# Altium project MB1355.PrjPcb
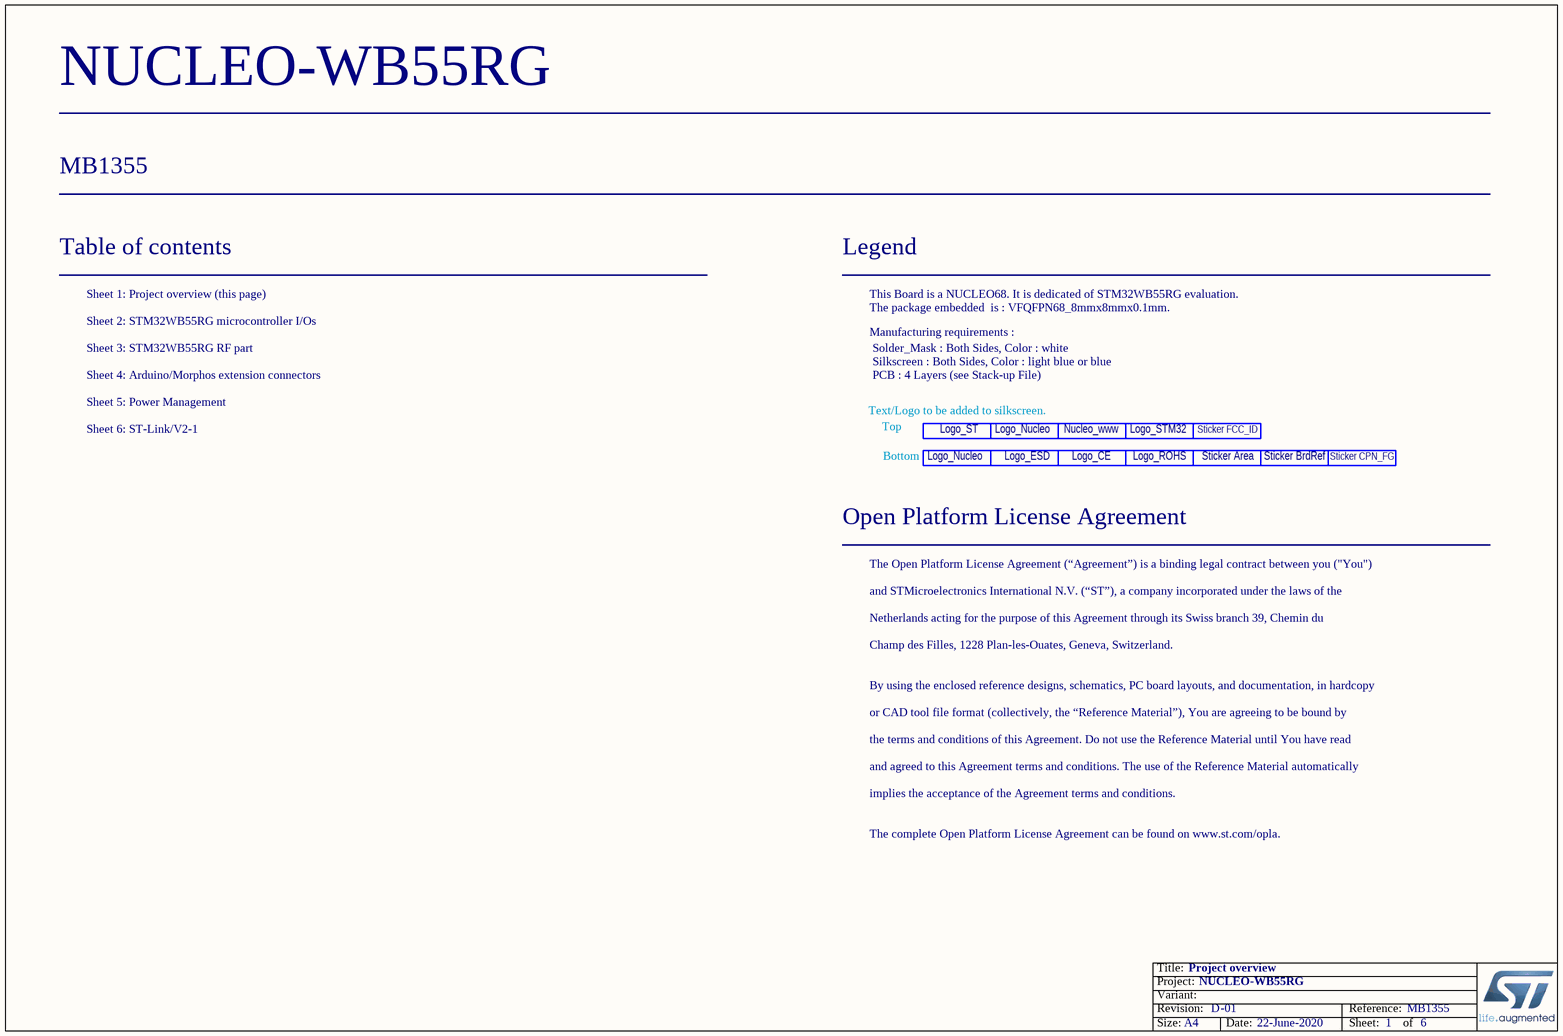
[diagram p0: Project_Overview.SchDoc]
Board_Assembly_Revision: 01; Board_Document_Date: 22-June-2020; Board_Name: NUCLEO-WB55RG; Board_PCB_Revision: D; Board_Reference: MB1355
6 sheets, 209 parts. Net scope: flat (ports and power ports of the same name join across sheets).
Board file: MB1355.PcbDoc
Sheets:
  Project_Overview.SchDoc
  MCU.SchDoc
  RF.SchDoc
  Extension_CN.SchDoc
  Power_Management.SchDoc
  ST_LINK_V2-1.SCHDOC

## Sheet Project_Overview.SchDoc: Project overview
size A4; Date: Not used; ApprovedBy: Not used; CheckedBy: Not used; Author: Ph.A; CompanyName: STMicroelectronics; DrawnBy: Not used; Engineer: Not used; Organization: Not used; Address1: Not used; Address2: Not used; Address3: Not used; Address4: Not used; DocumentNumber: Not used; Revision: Not used; SheetNumber: 1; SheetTotal: 6; CurrentTime: Not used; CurrentDate: Not used; Time: Not used; DocumentFullPathAndName: Not used; DocumentName: Not used; ModifiedDate: Not used; ImagePath: Not used; ProjectName: Not used; Application_BuildNumber: Not used

### Parts
Label_1  LOGO_ST  [LOGO_ST_Size3]  (value not drawn)
Label_2  LOGO_ROHS  [SYMBOL_RoHS]  (value not drawn)
Label_3  LOGO_Nucleo_www  [LOGO_Nucleo_www]  (value not drawn)
Label_4  LOGO_STM32  [LOGO_STM32]  (value not drawn)
Label_5  LOGO_Nucleo  [LOGO_Nucleo]  (value not drawn)
Label_6  LOGO_CE  [LOGO CE]  (value not drawn)
Label_7  LOGO_ESD  [LOGO ESD]  (value not drawn)
Label_8  LOGO_StickerArea_W21x6  [LOGO_StickerArea_Border]  (value not drawn)
Label_9  LOGO_Nucleo  [LOGO_Nucleo]  (value not drawn)
STICKER_1  FCC_ID_Sticker_16x5  [Sticker_FCC_ID 16x5mm]  (value not drawn)
STICKER_2  Sticker_BrdRef_21x5  [Sticker_BrdRef_21x5mm]  (value not drawn)
STICKER_3  Sticker_CPN_FG 16x5  [Sticker_CPN_FG 16x5mm]  (value not drawn)

### Notes on the sheet
- Table of contents
- Sheet 1: Project overview (this page)
- Legend
- This Board is a NUCLEO68. It is dedicated of STM32WB55RG evaluation.
- The package embedded  is : VFQFPN68_8mmx8mmx0.1mm.
- Sheet 2: STM32WB55RG microcontroller I/Os
- Sheet 3: STM32WB55RG RF part
- Sheet 4: Arduino/Morphos extension connectors
- Manufacturing requirements :
- Silkscreen : Both Sides, Color : light blue or blue
- Solder_Mask : Both Sides, Color : white
- PCB : 4 Layers (see Stack-up File)
- Sheet 6: ST-Link/V2-1
- Sheet 5: Power Management
- Text/Logo to be added to silkscreen.
- Top
- Bottom
- Open Platform License Agreement
- The Open Platform License Agreement (“Agreement”) is a binding legal contract between you ("You")
- and STMicroelectronics International N.V. (“ST”), a company incorporated under the laws of the
- Netherlands acting for the purpose of this Agreement through its Swiss branch 39, Chemin du
- Champ des Filles, 1228 Plan-les-Ouates, Geneva, Switzerland.
- By using the enclosed reference designs, schematics, PC board layouts, and documentation, in hardcopy
- or CAD tool file format (collectively, the “Reference Material”), You are agreeing to be bound by
- the terms and conditions of this Agreement. Do not use the Reference Material until You have read
- and agreed to this Agreement terms and conditions. The use of the Reference Material automatically
- implies the acceptance of the Agreement terms and conditions.
- The complete Open Platform License Agreement can be found on www.st.com/opla.
- Title:
- Project:
- Size:
- Revision:
- Variant:
- A4
- -
- Date:
- Reference:
- Sheet:
- of
- (in symbol LOGO_CE) Logo_CE
- (in symbol LOGO_ESD) Logo_ESD
- (in symbol LOGO_Nucleo) Logo_Nucleo
- (in symbol LOGO_Nucleo_www) Nucleo_www
- (in symbol LOGO_ROHS) Logo_ROHS
- (in symbol LOGO_ST) Logo_ST
- (in symbol LOGO_Sticker_BrdRef) Sticker BrdRef
- (in symbol LOGO_Sticker_CPN_FG) Sticker CPN_FG
- (in symbol LOGO_Sticker_FCC_ID) Sticker FCC_ID
- (in symbol LOGO_StickerArea_W21x6) Sticker Area
- (in symbol LOGO_STM32) Logo_STM32

### Library data of the parts
Label_1 = LOGO_ST: Silkscreen Only: YES
Label_2 = LOGO_ROHS: Silkscreen Only: YES
Label_4 = LOGO_STM32: Silkscreen Only: YES
Label_5 Label_9 = LOGO_Nucleo: Silkscreen Only: YES
Label_6 = LOGO_CE: Silkscreen Only: YES
Label_7 = LOGO_ESD: Silkscreen Only: YES
Label_8 = LOGO_StickerArea_W21x6: Silkscreen Only: YES
STICKER_1 = LOGO_Sticker_FCC_ID: Sticker for FCC_ID 16x5mm
STICKER_2 = LOGO_Sticker_BrdRef: Sticker_BrdRef 21x5mm
STICKER_3 = LOGO_Sticker_CPN_FG: Sticker for CPN_FG 16x5mm

## Sheet MCU.SchDoc: STM32WB55RG microcontroller I/Os
size A4; Author: Ph.A; SheetNumber: 2; SheetTotal: 6
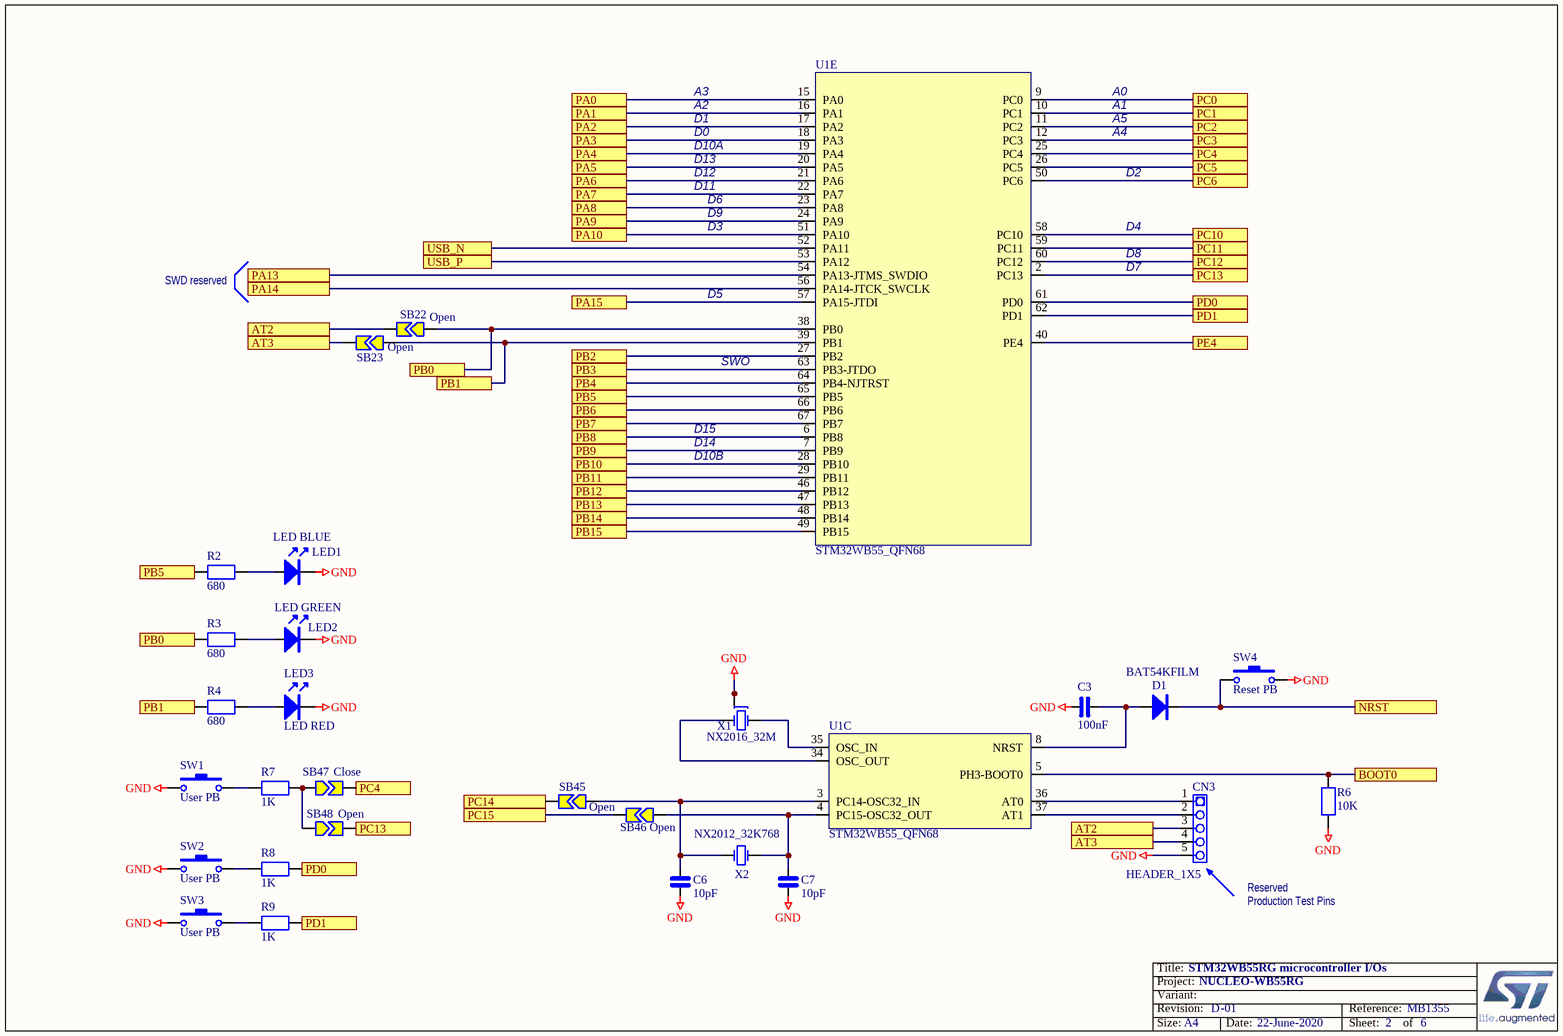
[diagram p1: MCU.SchDoc]

### Parts
C3  100nF  [0402_CAP_NPOL]
C6  10pF  [0402_CAP_NPOL]
C7  10pF  [0402_CAP_NPOL]
CN3  HEADER_1X5  [Header NF 1x5x2.54 TH]
D1  BAT54KFILM  [SOD523]
LED1  LED BLUE  [0603_LED_Blue]
LED2  LED GREEN  [0603_LED_GREEN]
LED3  LED RED  [0603_LED_RED]
R2  680  [0402_RES]
R3  680  [0402_RES]
R4  680  [0402_RES]
R6  10K  [0402_RES]
R7  1K  [0402_RES]
R8  1K  [0402_RES]
R9  1K  [0402_RES]
SB22  Open  [SB-tiny]
SB23  Open  [SB-tiny]
SB45  Open  [SB-tiny]
SB46  Open  [SB-tiny]
SB47  Close  [SB-tiny]
SB48  Open  [SB-tiny]
SW1  User PB  [SW-PB SMD KMR2]
SW2  User PB  [SW-PB SMD KMR2]
SW3  User PB  [SW-PB SMD KMR2]
SW4  Reset PB  [SW-PB SMD KMR2]
U1  STM32WB55_QFN68  [VFQFPN68_8x8x0.1_p0.4]  (parts C,E of 5)
X1  NX2016_32M  [NX2016_4P]
X2  NX2012_32K768  [NX2012_2P]

### Ports
AT2, AT3, BOOT0, NRST, PA0, PA1, PA2, PA3, PA4, PA5, PA6, PA7, PA8, PA9, PA10, PA13, PA14, PA15, PB0, PB1, PB2, PB3, PB4, PB5, PB6, PB7, PB8, PB9, PB10, PB11, PB12, PB13, PB14, PB15, PC0, PC1, PC2, PC3, PC4, PC5, PC6, PC10, PC11, PC12, PC13, PC14, PC15, PD0, PD1, PE4, USB_N, USB_P

### Nets
GND: C3.1 C6.2 C7.2 CN3.5 LED1.K LED2.K LED3.K R6.2 SW1.1 SW2.1 SW3.1 SW4.2 X1.2 X1.4
AT2: CN3.3 SB22.2 ; port AT2
AT3: CN3.4 SB23.2 ; port AT3
BOOT0: R6.1 U1.5(PH3-BOOT0) ; port BOOT0
NRST: D1.K SW4.1 ; port NRST
PA0: U1.15(PA0) ; port PA0
PA1: U1.16(PA1) ; port PA1
PA2: U1.17(PA2) ; port PA2
PA3: U1.18(PA3) ; port PA3
PA4: U1.19(PA4) ; port PA4
PA5: U1.20(PA5) ; port PA5
PA6: U1.21(PA6) ; port PA6
PA7: U1.22(PA7) ; port PA7
PA8: U1.23(PA8) ; port PA8
PA9: U1.24(PA9) ; port PA9
PA10: U1.51(PA10) ; port PA10
PA13: U1.54(PA13-JTMS_SWDIO) ; port PA13
PA14: U1.56(PA14-JTCK_SWCLK) ; port PA14
PA15: U1.57(PA15-JTDI) ; port PA15
PB0: R3.1 SB22.1 U1.38(PB0) ; port PB0
PB1: R4.1 SB23.1 U1.39(PB1) ; port PB1
PB2: U1.27(PB2) ; port PB2
PB3: U1.63(PB3-JTDO) ; port PB3
PB4: U1.64(PB4-NJTRST) ; port PB4
PB5: R2.1 U1.65(PB5) ; port PB5
PB6: U1.66(PB6) ; port PB6
PB7: U1.67(PB7) ; port PB7
PB8: U1.6(PB8) ; port PB8
PB9: U1.7(PB9) ; port PB9
PB10: U1.28(PB10) ; port PB10
PB11: U1.29(PB11) ; port PB11
PB12: U1.46(PB12) ; port PB12
PB13: U1.47(PB13) ; port PB13
PB14: U1.48(PB14) ; port PB14
PB15: U1.49(PB15) ; port PB15
PC0: U1.9(PC0) ; port PC0
PC1: U1.10(PC1) ; port PC1
PC2: U1.11(PC2) ; port PC2
PC3: U1.12(PC3) ; port PC3
PC4: SB47.2 U1.25(PC4) ; port PC4
PC5: U1.26(PC5) ; port PC5
PC6: U1.50(PC6) ; port PC6
PC10: U1.58(PC10) ; port PC10
PC11: U1.59(PC11) ; port PC11
PC12: U1.60(PC12) ; port PC12
PC13: SB48.2 U1.2(PC13) ; port PC13
PC14: SB45.2 ; port PC14
PC15: SB46.2 ; port PC15
PD0: R8.2 U1.61(PD0) ; port PD0
PD1: R9.2 U1.62(PD1) ; port PD1
PE4: U1.40(PE4) ; port PE4
USB_N: U1.52(PA11) ; port USB_N
USB_P: U1.53(PA12) ; port USB_P
NetC3_2: C3.2 D1.A U1.8(NRST)
NetC6_1: C6.1 SB45.1 U1.3(PC14-OSC32_IN) X2.1(OSC1)
NetC7_1: C7.1 SB46.1 U1.4(PC15-OSC32_OUT) X2.2(OSC2)
NetCN3_1: CN3.1 U1.36(AT0)
NetCN3_2: CN3.2 U1.37(AT1)
NetLED1_A: LED1.A R2.2
NetLED2_A: LED2.A R3.2
NetLED3_A: LED3.A R4.2
NetR7_1: R7.1 SW1.2
NetR7_2: R7.2 SB47.1 SB48.1
NetR8_1: R8.1 SW2.2
NetR9_1: R9.1 SW3.2
NetU1_34: U1.34(OSC_OUT) X1.3(OSC2)
NetU1_35: U1.35(OSC_IN) X1.1(OSC1)

### Notes on the sheet
- A2
- A3
- A0
- A1
- D12
- D13
- D0
- D1
- D10A
- A4
- A5
- D2
- D11
- D9
- D3
- D6
- D4
- SWD reserved
- D5
- D7
- D8
- SWO
- D14
- D15
- D10B
- Production Test Pins
- Reserved
- Title:
- Project:
- Size:
- Revision:
- Variant:
- -
- Date:
- Reference:
- Sheet:
- of

### Library data of the parts
C3 C6 C7 = CAP_NPOL: Capacitor_not polarized
D1 = BAT54K: Schottky Diode
LED1-LED3 = LED: Light-Emitting Diode; Part Number A: *
  LED1: Color: BLUE
R2-R4 R6-R9 = RES: Resistor
SB22 SB23 SB45-SB48 = Strap2: Solder Jumper; Solder: YES; Published: 24-Mar-1999; Revision: July-2002: Re-released for DXP Platform.; Publisher: Altium Limited
SW1-SW4 = SW-PB_1: Push-button SMD; Order code RS: 102-412
U1 = STM32WBxx_QFN68
X1 = NX2016_32M: Crystal NDK 2.0x1.6mm  32 MHz; Manufacturer P/N: NX2016SA 32 MHz EXS00A-CS06654; Ref: NX2016SA 32MHz  EXS00A-CS06654  Référence interne NDK : X5087283; Manufacturer: NDK
X2 = NX2012_32K768: Crystal NDK 2.0x1.2mm  32.768 KHz; Manufacturer P/N: NX2012SA 32.768KHz  EXS00A-MU00389; Ref: NX2012SA 32.768KHz  EXS00A-MU00389  Référence interne NDK : X3037088; Manufacturer: NDK

## Sheet RF.SchDoc: STM32WB55RG RF part
size A4; Author: PhA; SheetNumber: 3; SheetTotal: 6
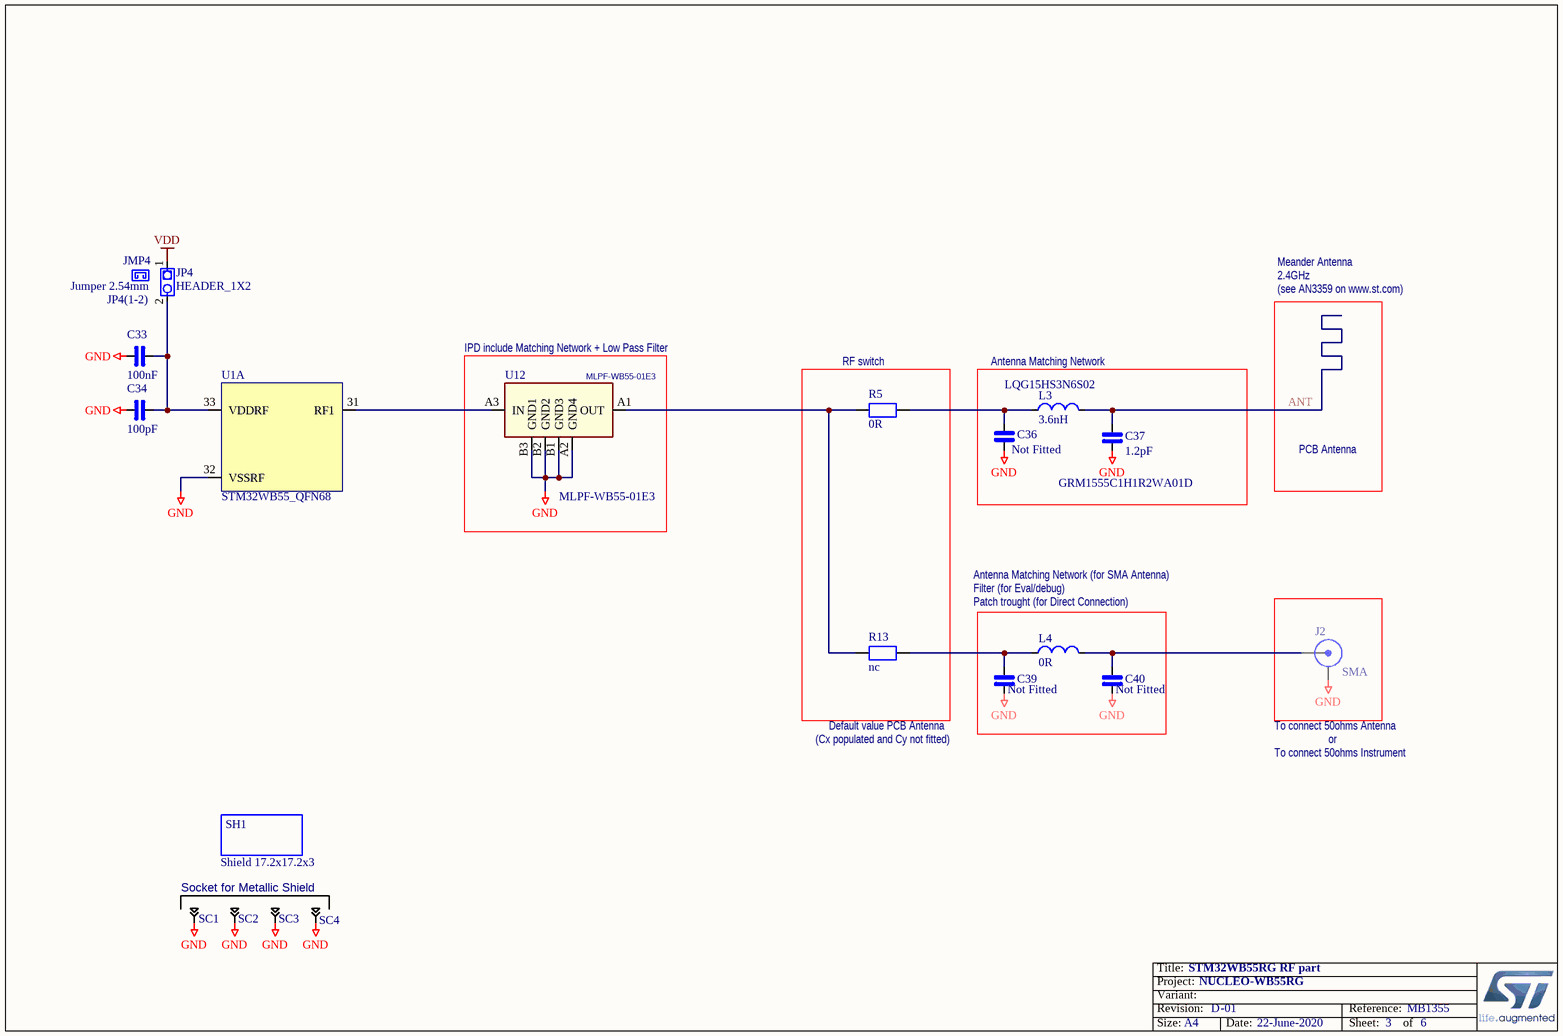
[diagram p2: RF.SchDoc]

### Parts
C33  100nF  [0402_CAP_NPOL]
C34  100pF  [0402_CAP_NPOL]
C36  Fitted: Not Fitted  [0402_CAP_NPOL]
C37  1.2pF  Ref: GRM1555C1H1R2WA01D  [0402_CAP_NPOL]
C39  Fitted: Not Fitted  [0402_CAP_NPOL]
C40  Fitted: Not Fitted  [0402_CAP_NPOL]
J2  SMA  [SMA_T_9.52_NF]
JMP4  Jumper 2.54mm  default: JP4(1-2)  [Jumper 2.54mm BLACK]
JP4  HEADER_1X2  [Header M 1x2x2.54 TH V]
L3  3.6nH  Ref: LQG15HS3N6S02  [0402_COIL]
L4  0R  [0402_COIL]
R5  0R  [0402_RES]
R13  nc  [0402_RES]
SC1  Shield Clip_A 3.9x1.1x1.28  [Shield Clip_A 3.9x1.1x1.28]  (value not drawn)
SC2  Shield Clip_A 3.9x1.1x1.28  [Shield Clip_A 3.9x1.1x1.28]  (value not drawn)
SC3  Shield Clip_A 3.9x1.1x1.28  [Shield Clip_A 3.9x1.1x1.28]  (value not drawn)
SC4  Shield Clip_A 3.9x1.1x1.28  [Shield Clip_A 3.9x1.1x1.28]  (value not drawn)
SH1  Shield 17.2x17.2x3  [Shield 17.2x17.2x3]
U1  STM32WB55_QFN68  [VFQFPN68_8x8x0.1_p0.4]  (part A of 5)
U12  MLPF-WB55-01E3  [ST_CSP650x58P2x3_160x100x42]

### Blocks framed on the sheet
IPD include Matching Network + Low Pass Filter: U12
RF switch: R5 R13
Antenna Matching Network: C36 C37 L3

### Nets
GND: C33.1 C34.1 C36.2 C37.1 C39.1 C40.1 J2.2(Y) SC1.1 SC2.1 SC3.1 SC4.1 U1.32(VSSRF) U12.A2(GND4) U12.B1(GND3) U12.B2(GND2) U12.B3(GND1)
VDD: JP4.1
ANT: C37.2 L3.2
NetC33_2: C33.2 C34.2 JP4.2 U1.33(VDDRF)
NetC36_1: C36.1 L3.1 R5.2
NetC39_2: C39.2 L4.1 R13.2
NetC40_2: C40.2 J2.1(X) L4.2
NetR5_1: R5.1 R13.1 U12.A1(OUT)
NetU1_31: U1.31(RF1) U12.A3(IN)

### Notes on the sheet
- Meander Antenna
- 2.4GHz
- (see AN3359 on www.st.com)
- PCB Antenna
- Antenna Matching Network (for SMA Antenna)
- Filter (for Eval/debug)
- Patch trought (for Direct Connection)
- (near C39) (Cx populated and Cy not fitted)
- Default value PCB Antenna
- To connect 50ohms Antenna
- To connect 50ohms Instrument
- or
- Socket for Metallic Shield
- Title:
- Project:
- Size:
- Revision:
- Variant:
- A4
- -
- Date:
- Reference:
- Sheet:
- of

### Library data of the parts
C33 C34 C36 C37 C39 C40 = CAP_NPOL: Capacitor_not polarized
  C37: Fitted: Fitted
JP4 = HEADER_1X2_L
L3 L4 = INDUCTOR_SMD_STDL
R5 R13 = RES: Resistor
SC1-SC4 = Shield Clip_A 3.9x1.1x1.28: Harwin S0951-46R
SH1 = Shield
U1 = STM32WBxx_QFN68
U12 = MCD-02059: 2.4 GHz low pass filter matched to STM32WBx5Cx/Rx; Part_Type: IC; Manufacturer: STMICROELECTRONICS; ECCN_US: EAR99; ECCN_EU: NEC; Provided_By: SUBCO with ST control; Internal_Part_Number: MCD-02059; Value: MLPF-WB55-01E3; Status: New; Manufacturer_Part_Number: MLPF-WB55-01E3; Package: Bumpless CSP; ComponentLink1Description: Datasheet; ComponentLink1URL: http://tunmcdsvn.tun.st.com/Component_Datasheet_Library/Trunk/IC/STM_Filter_MLPF-WB55-01E3/STM_Filter_MLPF-WB55-01E3.pdf

## Sheet Extension_CN.SchDoc: Arduino/Morphos extension connectors
size A4; Author: Ph.A; SheetNumber: 4; SheetTotal: 6
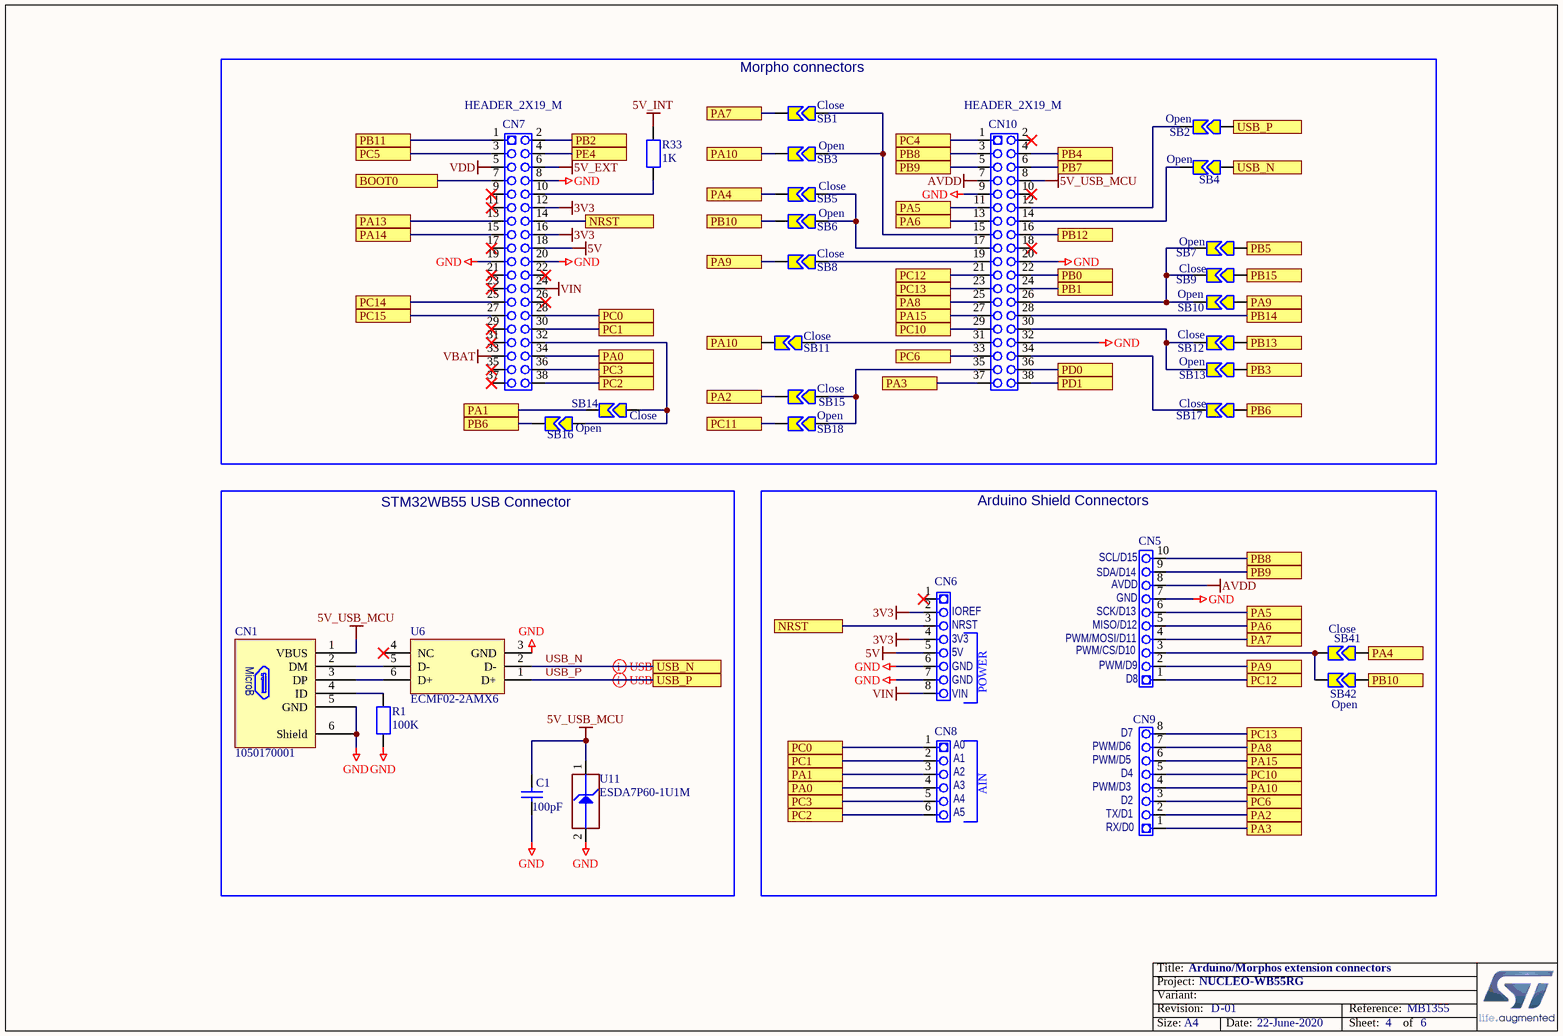
[diagram p3: Extension_CN.SchDoc]

### Parts
C1  value 100pF  [C0402]  (hidden comment: Capacitor)
CN1  1050170001  [USBMICROB_MOLEX_105017-0001_H2P90]
CN5  HEADER_1X10  [Header F 1x10x2.54 TH V]  (value not drawn)
CN6  HEADER_1X8_F  [Header F 1x8x2.54 TH V]  (value not drawn)
CN7  HEADER_2X19_M  [Header M 2x19x2.54 TH M_top + M_bottom]
CN8  HEADER_1X6  [Header F 1x6x2.54 TH V]  (value not drawn)
CN9  HEADER_1X8_F  [Header F 1x8x2.54 TH V]  (value not drawn)
CN10  HEADER_2X19_M  [Header M 2x19x2.54 TH M_top + M_bottom]
R1  100K  [0402_RES]
R33  1K  [0402_RES]
SB1  Close  [SB-tiny]
SB2  Open  [SB-tiny]
SB3  Open  [SB-tiny]
SB4  Open  [SB-tiny]
SB5  Close  [SB-tiny]
SB6  Open  [SB-tiny]
SB7  Open  [SB-tiny]
SB8  Close  [SB-tiny]
SB9  Close  [SB-tiny]
SB10  Open  [SB-tiny]
SB11  Close  [SB-tiny]
SB12  Close  [SB-tiny]
SB13  Open  [SB-tiny]
SB14  Close  [SB-tiny]
SB15  Close  [SB-tiny]
SB16  Open  [SB-tiny]
SB17  Close  [SB-tiny]
SB18  Open  [SB-tiny]
SB41  Close  [SB-tiny]
SB42  Open  [SB-tiny]
U6  ECMF02-2AMX6  [ESD_QFN-6L_1P7X1P5_P050]
U11  value ESDA7P60-1U1M  [ESD_QFN2_1P6X1_P125]  (hidden comment: ESD-TRANSIL)

### Blocks framed on the sheet
Morpho connectors: CN7 CN10 R33 SB1-SB18
STM32WB55 USB Connector: C1 CN1 R1 U6 U11
Arduino Shield Connectors: CN5 CN6 CN8 CN9 SB41 SB42

### Ports
BOOT0, NRST, PA0, PA1, PA2, PA3, PA4, PA5, PA6, PA7, PA8, PA9, PA10, PA13, PA14, PA15, PB0, PB1, PB2, PB3, PB4, PB5, PB6, PB7, PB8, PB9, PB10, PB11, PB12, PB13, PB14, PB15, PC0, PC1, PC2, PC3, PC4, PC5, PC6, PC10, PC11, PC12, PC13, PC14, PC15, PD0, PD1, PE4, USB_N, USB_P

### Nets
3V3: CN6.2 CN6.4 CN7.12 CN7.16
5V: CN6.5 CN7.18
5V_EXT: CN7.6
5V_INT: R33.2
5V_USB_MCU: C1.2 CN1.1(VBUS) CN10.8 U11.1(IO1)
AVDD: CN5.8 CN10.7
GND: C1.1 CN1.5(GND) CN1.6(Shield) CN5.7 CN6.6 CN6.7 CN7.8 CN7.19 CN7.20 CN10.9 CN10.20 CN10.32 R1.1 U6.3(GND) U11.2(GND)
VBAT: CN7.33
VDD: CN7.5
VIN: CN6.8 CN7.24
BOOT0: CN7.7 ; port BOOT0
NRST: CN6.3 CN7.14 ; port NRST
PA0: CN7.34 CN8.4 ; port PA0
PA1: CN8.3 SB14.2 ; port PA1
PA2: CN9.2 SB15.2 ; port PA2
PA3: CN9.1 CN10.37 ; port PA3
PA4: SB5.2 SB41.1 ; port PA4
PA5: CN5.6 CN10.11 ; port PA5
PA6: CN5.5 CN10.13 ; port PA6
PA7: CN5.4 SB1.2 ; port PA7
PA8: CN9.7 CN10.25 ; port PA8
PA9: CN5.2 SB8.2 SB10.1 ; port PA9
PA10: CN9.4 SB3.2 SB11.2 ; port PA10
PA13: CN7.13 ; port PA13
PA14: CN7.15 ; port PA14
PA15: CN9.6 CN10.27 ; port PA15
PB0: CN10.22 ; port PB0
PB1: CN10.24 ; port PB1
PB2: CN7.2 ; port PB2
PB3: SB13.1 ; port PB3
PB4: CN10.4 ; port PB4
PB5: SB7.1 ; port PB5
PB6: SB16.2 SB17.1 ; port PB6
PB7: CN10.6 ; port PB7
PB8: CN5.10 CN10.3 ; port PB8
PB9: CN5.9 CN10.5 ; port PB9
PB10: SB6.2 SB42.1 ; port PB10
PB11: CN7.1 ; port PB11
PB12: CN10.16 ; port PB12
PB13: SB12.1 ; port PB13
PB14: CN10.28 ; port PB14
PB15: SB9.1 ; port PB15
PC0: CN7.28 CN8.1 ; port PC0
PC1: CN7.30 CN8.2 ; port PC1
PC2: CN7.38 CN8.6 ; port PC2
PC3: CN7.36 CN8.5 ; port PC3
PC4: CN10.1 ; port PC4
PC5: CN7.3 ; port PC5
PC6: CN9.3 CN10.33 ; port PC6
PC10: CN9.5 CN10.29 ; port PC10
PC11: SB18.2 ; port PC11
PC12: CN5.1 CN10.21 ; port PC12
PC13: CN9.8 CN10.23 ; port PC13
PC14: CN7.25 ; port PC14
PC15: CN7.27 ; port PC15
PD0: CN10.36 ; port PD0
PD1: CN10.38 ; port PD1
PE4: CN7.4 ; port PE4
USB_N: SB4.1 U6.2(D-) ; port USB_N
USB_P: SB2.1 U6.1(D+) ; port USB_P
NetCN1_2: CN1.2(DM) U6.5(D-)
NetCN1_3: CN1.3(DP) U6.6(D+)
NetCN1_4: CN1.4(ID) R1.2
NetCN5_3: CN5.3 SB41.2 SB42.2
NetCN7_10: CN7.10 R33.1
NetCN7_32: CN7.32 SB14.1 SB16.1
NetCN10_12: CN10.12 SB2.2
NetCN10_14: CN10.14 SB4.2
NetCN10_15: CN10.15 SB1.1 SB3.1
NetCN10_17: CN10.17 SB5.1 SB6.1
NetCN10_19: CN10.19 SB8.1
NetCN10_26: CN10.26 SB7.2 SB9.2 SB10.2
NetCN10_30: CN10.30 SB12.2 SB13.2
NetCN10_31: CN10.31 SB11.1
NetCN10_34: CN10.34 SB17.2
NetCN10_35: CN10.35 SB15.1 SB18.1

Not connected (* = marked no-connect by the designer): CN6 1*; CN7 9* 11* 17* 21* 22* 23* 26* 29* 31* 35* 37*; CN10 2* 10* 18*; U6 4(NC)*

### Layout directives
differential pair; net class DIFF90: USB_N, USB_P

### Notes on the sheet
- (near CN5) SDA/D14
- (near CN5) SCL/D15
- (near CN6) 3V3
- (near CN6) NRST
- (near CN6) IOREF
- (near CN5) PWM/MOSI/D11
- (near CN5) PWM/CS/D10
- (near CN5) MISO/D12
- (near CN5) SCK/D13
- (near CN5) AVDD
- (near CN5) GND
- (near CN6) GND
- (near CN6) VIN
- (near CN6) 5V
- (near CN6) POWER
- (near CN5) PWM/D9
- (near CN5) D8
- (near CN8) A0
- (near CN8) A1
- (near CN8) A2
- (near CN8) A3
- (near CN8) AIN
- (near CN9) PWM/D3
- (near CN9) PWM/D5
- (near CN9) PWM/D6
- (near CN9) D4
- (near CN9) D7
- (near CN8) A5
- (near CN8) A4
- (near CN9) RX/D0
- (near CN9) TX/D1
- (near CN9) D2
- Title:
- Project:
- Size:
- Revision:
- Variant:
- -
- Date:
- Reference:
- Sheet:
- of
- (in symbol 1050170001) MicroB

### Library data of the parts
C1 = MCD-00205: Capacitor, MLCC, 100pF, 50V, NPO, 5%, 0402, T=0,5mm; Manufacturer_Part_Number: CC0402JRNPO9BN101; Manufacturer: YAGEO; ECCN_US: EAR99; ECCN_EU: NEC; Provided_By: SUBCO; Internal_Part_Number: MCD-00205; Status: Released; Part_Type: Capacitor; Package: C0402; ComponentLink1Description: Datasheet; ComponentLink1URL: http://tunmcdsvn.tun.st.com/Component_Datasheet_Library/Trunk/Capacitors/Yageo_Capacitor_NP0_16V-to-50V
CN1 = 1050170001: USB-MICRO-B, 1050170001, SMT, MOLEX; Fitted: YES; Ordered_By: Subcon; ECCN_US/EU: n/a; Manuf_1: MOLEX; Manuf_Part_1: 1050170001; Distrib: DIGIKEY; Value: 1050170001; Order_Code: *
CN6 = HEADER_1X8: Specific Function: Arduino Power
CN7 = HEADER_2X19: Specific Function: Morpho CN7
CN9 = HEADER_1X8: Specific Function: Arduino Digital 1
CN10 = HEADER_2X19: Specific Function: Morpho CN10
R1 R33 = RES: Resistor
SB1-SB18 SB41 SB42 = Strap2: Solder Jumper; Solder: YES; Published: 24-Mar-1999; Revision: July-2002: Re-released for DXP Platform.; Publisher: Altium Limited
U6 = MCD-00649: Common mode filter with ESD protection for USB 2.0 interface; Part_Type: Diode; Manufacturer: STMICROELECTRONICS; BMS_Part_Number: 9151138; ECCN_US: EAR99; ECCN_EU: NEC; Provided_By: SUBCO with ST control; Internal_Part_Number: MCD-00649; Value: ECMF02-2AMX6; Status: Released; Manufacturer_Part_Number: ECMF02-2AMX6; ComponentLink1Description: Datasheet; ComponentLink1URL: http://tunmcdsvn.tun.st.com/Component_Datasheet_Library/Trunk/Diodes/STM_ESD_ECMF02-2AMX6
U11 = MCD-00251: High power transient voltage suppressor, 7V breakdown; Part_Type: Diode; Manufacturer: STMICROELECTRONICS; BMS_Part_Number: 9179042; ECCN_US: EAR99; ECCN_EU: NEC; Provided_By: SUBCO with ST control; Internal_Part_Number: MCD-00251; Status: Released; Manufacturer_Part_Number: ESDA7P60-1U1M; ComponentLink1Description: Datasheet; ComponentLink1URL: http://tunmcdsvn.tun.st.com/Component_Datasheet_Library/Trunk/Diodes/STM_ESD_ESDA7P60-1U1M

## Sheet Power_Management.SchDoc: Power Management
size A4; Author: Ph.A; SheetNumber: 5; SheetTotal: 6
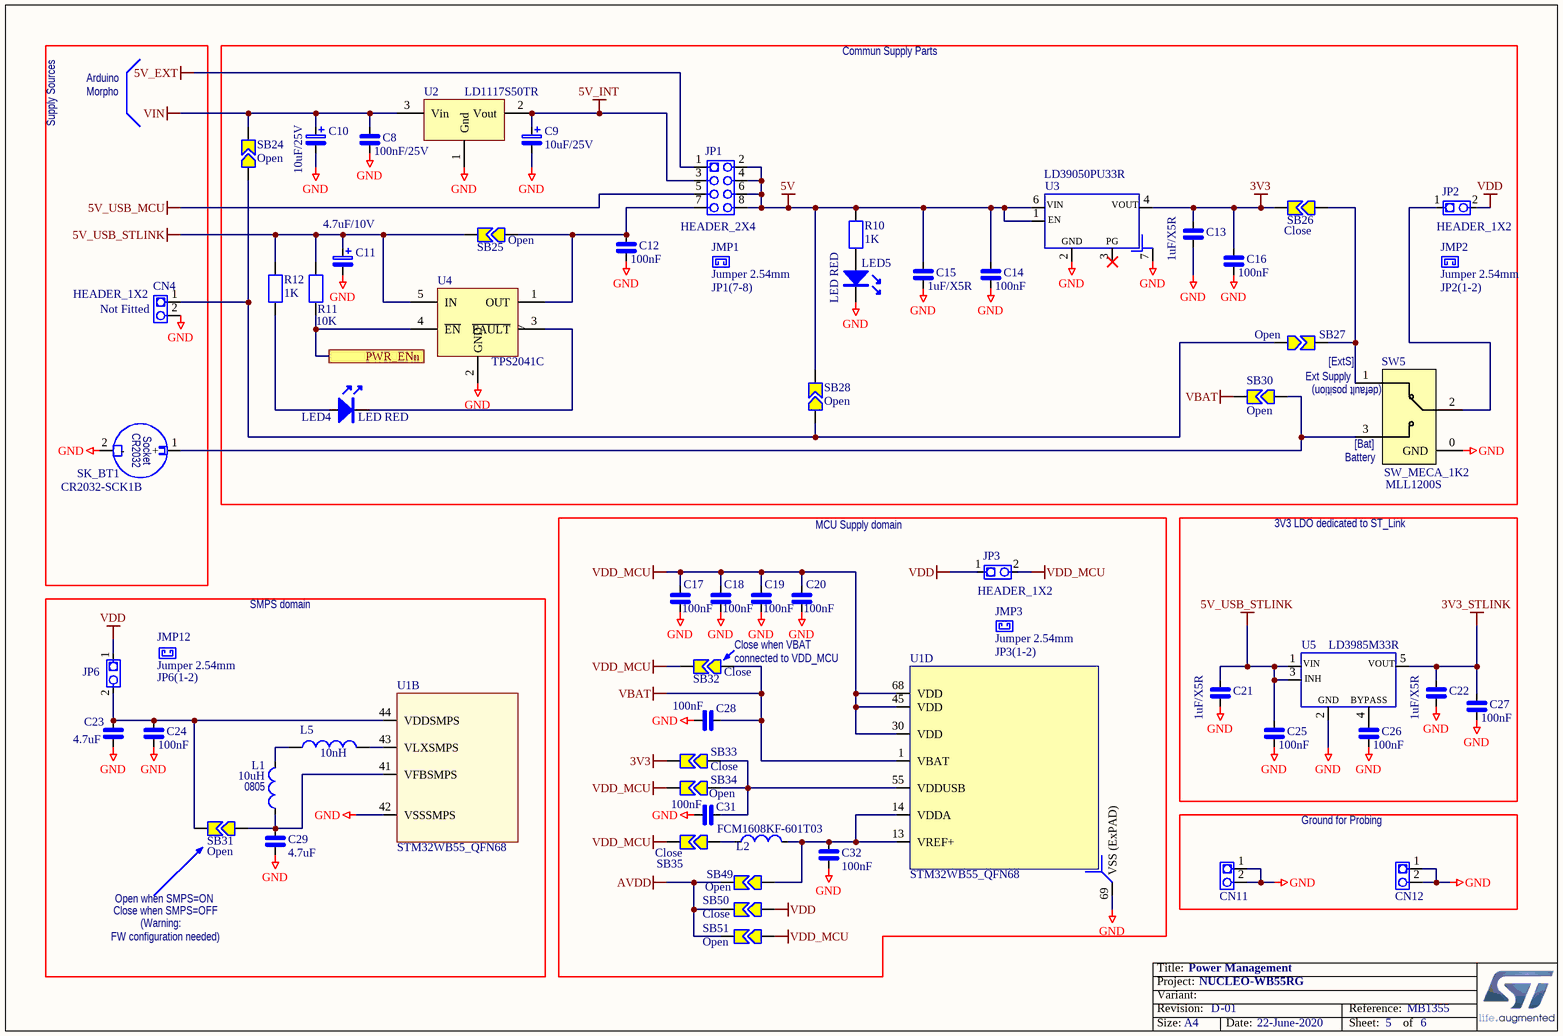
[diagram p4: Power_Management.SchDoc]

### Parts
C8  100nF/25V  [0402_CAP_NPOL]
C9  10uF/25V  [1210_CAP_POL]
C10  10uF/25V  [1210_CAP_POL]
C11  4.7uF/10V  [1210_CAP_POL]
C12  100nF  [0402_CAP_NPOL]
C13  1uF/X5R  [0603_CAP_NPOL]
C14  100nF  [0402_CAP_NPOL]
C15  1uF/X5R  [0603_CAP_NPOL]
C16  100nF  [0402_CAP_NPOL]
C17  100nF  [0402_CAP_NPOL]
C18  100nF  [0402_CAP_NPOL]
C19  100nF  [0402_CAP_NPOL]
C20  100nF  [0402_CAP_NPOL]
C21  1uF/X5R  [0603_CAP_NPOL]
C22  1uF/X5R  [0603_CAP_NPOL]
C23  4.7uF  [0402_CAP_NPOL]
C24  100nF  [0402_CAP_NPOL]
C25  100nF  [0402_CAP_NPOL]
C26  100nF  [0402_CAP_NPOL]
C27  100nF  [0402_CAP_NPOL]
C28  100nF  [0402_CAP_NPOL]
C29  4.7uF  [0402_CAP_NPOL]
C31  100nF  [0402_CAP_NPOL]
C32  100nF  [0402_CAP_NPOL]
CN4  HEADER_1X2  Fitted: Not Fitted  [Header NF 1x2x2.54 TH]
CN11  HEADER_1X2  [Header M 1x2x2.54 TH V]  (value not drawn)
CN12  HEADER_1X2  [Header M 1x2x2.54 TH V]  (value not drawn)
JMP1  Jumper 2.54mm  Default: JP1(7-8)  [Jumper 2.54mm BLACK]
JMP2  Jumper 2.54mm  Default: JP2(1-2)  [Jumper 2.54mm BLACK]
JMP3  Jumper 2.54mm  default: JP3(1-2)  [Jumper 2.54mm BLACK]
JMP12  Jumper 2.54mm  default: JP6(1-2)  [Jumper 2.54mm BLACK]
JP1  HEADER_2X4  [Header M 2x4x2.54 TH V]
JP2  HEADER_1X2  [Header M 1x2x2.54 TH V]
JP3  HEADER_1X2  [Header M 1x2x2.54 TH V]
JP6  HEADER_1X2  [Header M 1x2x2.54 TH V]  (value not drawn)
L1  10uH  [0805_COIL]
L2  FCM1608KF-601T03  [0603_COIL]
L5  value 10nH  [IND_0402_MURATA_LQW15AN_H0P5]  (hidden comment: Inductor)
LED4  LED RED  [0603_LED_RED]
LED5  LED RED  [0603_LED_RED]
R10  1K  [0402_RES]
R11  10K  [0402_RES]
R12  1K  [0402_RES]
SB24  Open  [SB-tiny]
SB25  Open  [SB-tiny]
SB26  Close  [SB-tiny]
SB27  Open  [SB-tiny]
SB28  Open  [SB-tiny]
SB30  Open  [SB-tiny]
SB31  Open  [SB-tiny]
SB32  Close  [SB-tiny]
SB33  Close  [SB-tiny]
SB34  Open  [SB-tiny]
SB35  Close  [SB-tiny]
SB49  Open  [SB-tiny]
SB50  Close  [SB-tiny]
SB51  Open  [SB-tiny]
SK_BT1  CR2032-SCK1B  [CR2032-SCK1]
SW5  SW_MECA_1K2  value MLL1200S  [SWI_SPDT-RA_TE-CONNECTIVITY_MLL1200S_1P2T]
U1  STM32WB55_QFN68  [VFQFPN68_8x8x0.1_p0.4]  (parts B,D of 5)
U2  LD1117S50TR  [SOT223_SC73_A]
U3  LD39050PU33R  [DFN6 3x3mm]
U4  TPS2041C  [MOS_SOT23-5L]
U5  LD3985M33R  [SOT23-5]

### Blocks framed on the sheet
3V3 LDO dedicated to ST_Link: C21 C22 C25-C27 U5
Ground for Probing: CN11 CN12

### Ports
PWR_ENn

### Nets
3V3: C13.1 C16.1 SB26.2 SB33.2 U3.4(VOUT)
3V3_STLINK: C22.1 C27.1 U5.5(VOUT)
5V: C14.1 C15.1 JP1.2 JP1.4 JP1.6 JP1.8 R10.1 SB28.2 U3.1(EN) U3.6(VIN)
5V_EXT: JP1.1
5V_INT: C9.1 JP1.3 U2.2(Vout)
5V_USB_MCU: JP1.5
5V_USB_STLINK: C11.1 C21.1 C25.1 R11.1 R12.1 SB25.2 U4.5(IN) U5.1(VIN) U5.3(CE)
AVDD: SB49.2 SB50.2 SB51.2
GND: C8.2 C9.2 C10.2 C11.2 C12.2 C13.2 C14.2 C15.2 C16.2 C17.2 C18.2 C19.2 C20.2 C21.2 C22.2 C23.2 C24.2 C25.2 C26.2 C27.2 C28.2 C29.2 C31.2 C32.2 CN4.2 CN11.1 CN11.2 CN12.1 CN12.2 LED5.K SK_BT1.2(-) SW5.0(GND) U1.42(VSSSMPS) U1.69(VSS_(ExPAD)) U2.1(Gnd) U3.2(VSS) U3.7 U4.2(GND) U5.2(VSS)
VBAT: C28.1 SB30.2 SB32.1 U1.1(VBAT)
VDD: JP2.2 JP3.1 JP6.1 SB50.1
VDD_MCU: C17.1 C18.1 C19.1 C20.1 JP3.2 SB32.2 SB34.2 SB35.2 SB51.1 U1.30(VDD) U1.45(VDD) U1.68(VDD)
VIN: C8.1 C10.1 SB24.2 U2.3(Vin)
PWR_ENn: R11.2 U4.4(~{EN}) ; port PWR_ENn
NetC12_1: C12.1 JP1.7 SB25.1 U4.1(OUT)
NetC23_1: C23.1 C24.1 JP6.2 SB31.2 U1.44(VDDSMPS)
NetC26_1: C26.1 U5.4(BYPASS)
NetC29_1: C29.1 L1.1 SB31.1 U1.41(VFBSMPS)
NetC31_1: C31.1 SB33.1 SB34.1 U1.55(VDDUSB)
NetC32_1: C32.1 L2.2 SB49.1 U1.13(VREF+) U1.14(VDDA)
NetCN4_1: CN4.1 SB24.1 SB27.1 SB28.1
NetJP2_1: JP2.1 SW5.2
NetL1_2: L1.2 L5.1
NetL2_1: L2.1 SB35.1
NetL5_2: L5.2 U1.43(VLXSMPS)
NetLED4_A: LED4.A R12.2
NetLED4_K: LED4.K U4.3(~{FAULT})
NetLED5_A: LED5.A R10.2
NetSB26_1: SB26.1 SB27.2 SW5.1
NetSB30_1: SB30.1 SK_BT1.1(+) SW5.3

Not connected (* = marked no-connect by the designer): U3 3(PG)*

### Notes on the sheet
- Arduino
- Morpho
- Commun Supply Parts
- Supply Sources
- Ext Supply
- [ExtS]
- (default position)
- (near SW5) [Bat]
- (near SW5) Battery
- MCU Supply domain
- SMPS domain
- (near SB32) Close when VBAT
- (near SB32) connected to VDD_MCU
- (near L1) 0805
- Close when SMPS=OFF
- Open when SMPS=ON
- FW configuration needed)
- (Warning:
- Title:
- Project:
- Size:
- Revision:
- Variant:
- A4
- -
- Date:
- Reference:
- Sheet:
- of
- (in symbol CR2032-SCK1B) CR2032; Socket
- (in symbol LD3985M33R) INH; GND
- (in symbol LD39050PU33R) GND

### Library data of the parts
C8 C12-C29 C31 C32 = CAP_NPOL: Capacitor_not polarized
C9-C11 = CAP_POL: Condensateur_polarise
JP2 JP3 JP6 = HEADER_1X2_L
L1 = IND_74479777310A: Coil Wurtz 10uH ref: 74479777310A
L2 = IND_FCM1608KF-601T03
L5 = MCD-02063: inductor, 10nH +-2%, 100mA max,1.3 ohm DC max, Q min = 13,0402; Manufacturer_Part_Number: LQP15MN10NG02; Manufacturer: MURATA; ECCN_US: EAR99; ECCN_EU: NEC; Provided_By: SUBCO; Order_Code_RS: 167-3827; Internal_Part_Number: MCD-02063; Status: Checked; Part_Type: Inductor; Package: L0402; ComponentLink1Description: Datasheet; ComponentLink1URL: http://tunmcdsvn.tun.st.com/Component_Datasheet_Library/Trunk/Inductors/Murata_inductor_LQP15MN10NG02/Murata_inductor_LQP15MN10NG02.pdf; Alternate_Manufacturer_Part_Number: N/A; Alternate_Manufacturer: N/A; Order_Code_Digikey: 490-6743-1-ND; Order_Code_Farnell: 1762617
LED4 LED5 = LED: Light-Emitting Diode; Part Number A: *
R10-R12 = RES: Resistor
SB24-SB28 SB30-SB35 SB49-SB51 = Strap2: Solder Jumper; Solder: YES; Published: 24-Mar-1999; Revision: July-2002: Re-released for DXP Platform.; Publisher: Altium Limited
SW5 = MCD-02081: SPDT RA SMT SLIDE SWITCH; Part_Type: Connector; Manufacturer: TE_Connectivity; ECCN_US: EAR99; ECCN_EU: NEC; Provided_By: SUBCO; Internal_Part_Number: MCD-02081; Status: Checked; Manufacturer_Part_Number: MLL1200S; ComponentLink1Description: Datasheet; ComponentLink1URL: http://tunmcdsvn.tun.st.com/Component_Datasheet_Library/Trunk/Connectors/TE_Connectivity_MLL1200S/TE_MLL1200S.pdf
U1 = STM32WBxx_QFN68
U2 = LD1117S50TR: IC REG LDO 5V 0.8A SOT223; Manuf_1: STM; ECCN_US/EU: EAR99/NEC; Ref St: 9176133; Fitted: YES; Manuf_Part_1: LD1117S50TR; Distrib: STM; Ordered_By: STM; Order_code: LD1117S50TR; Value: LD1117S50TR
U3 = LD39050PU33R: 3.3V voltage regulator 500mA
U4 = MCD-01785: 5V Power Switch, 0.85A, RDSon 130mOhm max, with active low enable pin; Part_Type: IC; Manufacturer_Part_Number: TPS2041CDBVT; Manufacturer: TEXAS INSTRUMENTS; ECCN_US: EAR99; ECCN_EU: NEC; Provided_By: SUBCO; Internal_Part_Number: MCD-01785; Value: TPS2041C; Status: Checked; Package: SOT23_5p; ComponentLink1Description: Datasheet; ComponentLink1URL: http://tunmcdsvn.tun.st.com/Component_Datasheet_Library/Trunk/IC/TI_PWR_SWITCH_5V_TPS20xxC
U5 = LD3985M33R: 3.3V low drop voltage regulator; Manufacturer: STMicroelectronics; Isortie max: 550mA; V entrée max: 6V; Manufacturer P/N: LD3985M33R; Order code Farnell: *; V sortie Typ. V: 3.3V; Temperature Max: +125°C; Type: Fixed; Temperature Min: -40°C

## Sheet ST_LINK_V2-1.SCHDOC: ST-Link/V2-1
size A4; Author: Ph.A; SheetNumber: 6; SheetTotal: 6
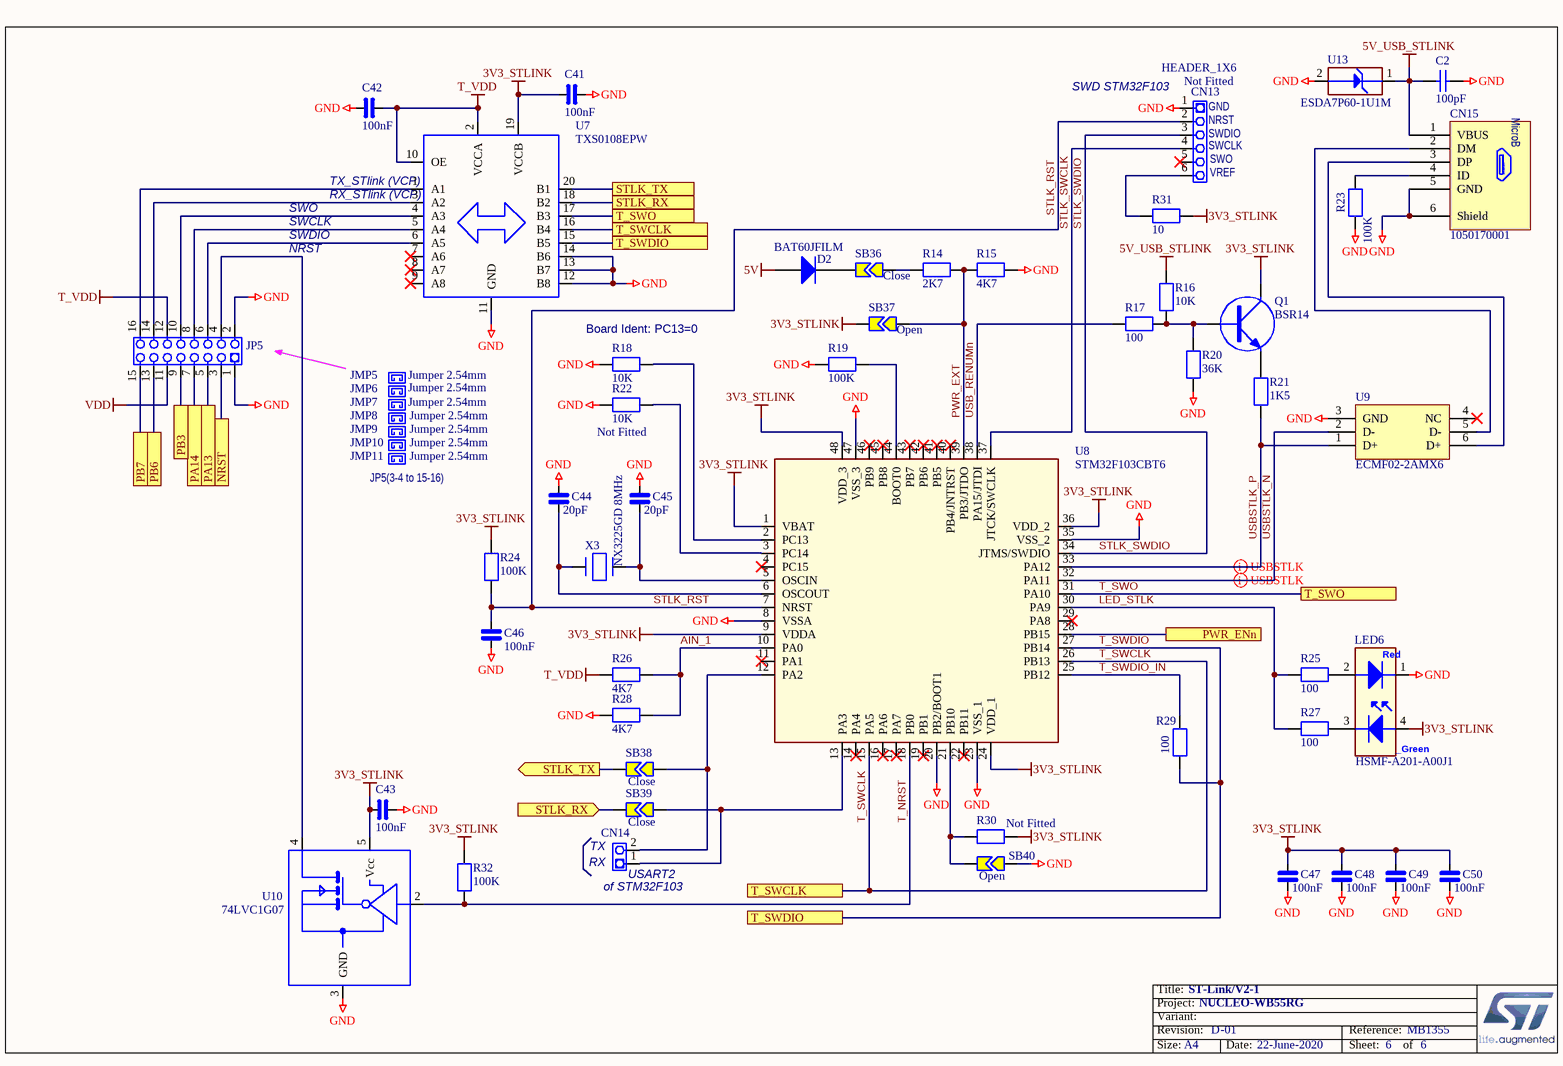
[diagram p5: ST_LINK_V2-1.SCHDOC]

### Parts
C2  value 100pF  [C0402]  (hidden comment: Capacitor)
C41  100nF  [0402_CAP_NPOL]
C42  100nF  [0402_CAP_NPOL]
C43  100nF  [0402_CAP_NPOL]
C44  20pF  [0402_CAP_NPOL]
C45  20pF  [0402_CAP_NPOL]
C46  100nF  [0402_CAP_NPOL]
C47  100nF  [0402_CAP_NPOL]
C48  100nF  [0402_CAP_NPOL]
C49  100nF  [0402_CAP_NPOL]
C50  100nF  [0402_CAP_NPOL]
CN13  HEADER_1X6  Fitted: Not Fitted  [Header NF 1x6x2.54 TH]
CN14  HEADER_1X2  [Header NF 1x2x2.54 TH]  (value not drawn)
CN15  1050170001  [USBMICROB_MOLEX_105017-0001_H2P90]
D2  BAT60JFILM  [SOD-323]
JMP5  Jumper 2.54mm  [Jumper 2.54mm BLACK]
JMP6  Jumper 2.54mm  [Jumper 2.54mm BLACK]
JMP7  Jumper 2.54mm  [Jumper 2.54mm BLACK]
JMP8  Jumper 2.54mm  [Jumper 2.54mm BLACK]
JMP9  Jumper 2.54mm  [Jumper 2.54mm BLACK]
JMP10  Jumper 2.54mm  [Jumper 2.54mm BLACK]
JMP11  Jumper 2.54mm  [Jumper 2.54mm BLACK]
JP5  HEADER_2X8  [Header M 2x8x2.54 TH V]  (value not drawn)
LED6  HSMF-A201-A00J1  [HSMF-A201]
Q1  BSR14  [SOT23-3]
R14  2K7  [0402_RES]
R15  4K7  [0402_RES]
R16  10K  [0402_RES]
R17  100  [0402_RES]
R18  10K  [0402_RES]
R19  100K  [0402_RES]
R20  36K  [0402_RES]
R21  1K5  [0402_RES]
R22  10K  Fitted: Not Fitted  [0402_RES]
R23  100K  [0402_RES]
R24  100K  [0402_RES]
R25  100  [0402_RES]
R26  4K7  [0402_RES]
R27  100  [0402_RES]
R28  4K7  [0402_RES]
R29  100  [0402_RES]
R30  Fitted: Not Fitted  [0402_RES]
R31  10  [0402_RES]
R32  100K  [0402_RES]
SB36  Close  [SB-tiny]
SB37  Open  [SB-tiny]
SB38  Close  [SB-tiny]
SB39  Close  [SB-tiny]
SB40  Open  [SB-tiny]
U7  TXS0108EPW  [TSSOP20]
U8  STM32F103CBT6  [LQFP48_7X7_P050]
U9  ECMF02-2AMX6  [ESD_QFN-6L_1P7X1P5_P050]
U10  74LVC1G07  [SOT353-1]
U13  value ESDA7P60-1U1M  [ESD_QFN2_1P6X1_P125]  (hidden comment: ESD-TRANSIL)
X3  value NX3225GD 8MHz  [CRY_NX3225GD_2P]  (hidden comment: XTAL_2_PINS)

### Ports
NRST, PA13, PA14, PB3, PB6, PB7, PWR_ENn, STLK_RX, STLK_RX (in), STLK_TX, STLK_TX (out), T_SWCLK, T_SWDIO, T_SWO

### Nets
3V3_STLINK: C41.1 C43.1 C47.1 C48.1 C49.1 C50.1 LED6.4 Q1.3(C) R24.2 R30.1 R31.2 R32.2 SB37.1 U7.19(VCCB) U8.1(VBAT) U8.9(VDDA) U8.24(VDD_1) U8.36(VDD_2) U8.48(VDD_3) U10.5(Vcc)
5V: D2.1(A)
5V_USB_STLINK: C2.1 CN15.1(VBUS) R16.2 U13.1(IO1)
GND: C2.2 C41.2 C42.1 C43.2 C44.1 C45.1 C46.1 C47.2 C48.2 C49.2 C50.2 CN13.1 CN15.5(GND) CN15.6(Shield) JP5.1 JP5.2 LED6.1 R15.2 R18.2 R19.1 R20.1 R22.2 R23.1 R28.2 SB40.2 U7.11(GND) U7.12(B8) U7.13(B7) U7.14(B6) U8.8(VSSA) U8.20(PB2/BOOT1) U8.23(VSS_1) U8.35(VSS_2) U8.47(VSS_3) U9.3(GND) U10.3(GND) U13.2(GND)
T_VDD: C42.2 JP5.12 R26.2 U7.2(VCCA) U7.10(OE)
VDD: JP5.11
AIN_1: R26.1 R28.1 U8.10(PA0)
LED_STLK: R25.2 R27.2 U8.30(PA9)
NRST: JP5.3 ; port NRST
PA13: JP5.5 ; port PA13
PA14: JP5.7 ; port PA14
PB3: JP5.9 ; port PB3
PB6: JP5.13 ; port PB6
PB7: JP5.15 ; port PB7
PWR_ENn: U8.28(PB15) ; port PWR_ENn
PWR_EXT: R14.2 R15.1 SB37.2 U8.39(PB3/JTDO)
STLK_RST: C46.2 CN13.2 R24.1 U8.7(NRST)
STLK_RX: SB39.1 U7.18(B2) ; port STLK_RX
STLK_SWCLK: CN13.4 U8.37(JTCK/SWCLK)
STLK_SWDIO: CN13.3 U8.34(JTMS/SWDIO)
STLK_TX: SB38.1 U7.20(B1) ; port STLK_TX
T_NRST: R32.1 U8.18(PB0) U10.2(A)
T_SWCLK: U7.16(B4) U8.15(PA5) U8.26(PB13) ; port T_SWCLK
T_SWDIO: R29.1 U7.15(B5) U8.27(PB14) ; port T_SWDIO
T_SWDIO_IN: R29.2 U8.25(PB12)
T_SWO: U7.17(B3) U8.31(PA10) ; port T_SWO
USB_RENUMn: R17.2 U8.38(PA15/JTDI)
USBSTLK_N: U8.32(PA11) U9.2(D-)
USBSTLK_P: R21.1 U8.33(PA12) U9.1(D+)
NetC44_2: C44.2 U8.6(OSCOUT) X3.2(X2)
NetC45_2: C45.2 U8.5(OSCIN) X3.1(X1)
NetCN13_6: CN13.6 R31.1
NetCN14_1: CN14.1 SB39.2 U8.13(PA3)
NetCN14_2: CN14.2 SB38.2 U8.12(PA2)
NetCN15_2: CN15.2(DM) U9.5(D-)
NetCN15_3: CN15.3(DP) U9.6(D+)
NetCN15_4: CN15.4(ID) R23.2
NetD2_2: D2.2(K) SB36.1
NetJP5_4: JP5.4 U10.4(Y)
NetJP5_6: JP5.6 U7.6(A5)
NetJP5_8: JP5.8 U7.5(A4)
NetJP5_10: JP5.10 U7.4(A3)
NetJP5_14: JP5.14 U7.3(A2)
NetJP5_16: JP5.16 U7.1(A1)
NetLED6_2: LED6.2 R25.1
NetLED6_3: LED6.3 R27.1
NetQ1_1: Q1.1(B) R16.1 R17.1 R20.2
NetQ1_2: Q1.2(E) R21.2
NetR14_1: R14.1 SB36.2
NetR18_1: R18.1 U8.2(PC13)
NetR19_2: R19.2 U8.44(BOOT0)
NetR22_1: R22.1 U8.3(PC14)
NetR30_2: R30.2 SB40.1 U8.21(PB10)

Not connected (* = marked no-connect by the designer): CN13 5*; U7 7(A6)* 8(A7)* 9(A8)*; U8 4(PC15)* 11(PA1)* 14(PA4)* 16(PA6)* 17(PA7)* 19(PB1)* 22(PB11)* 29(PA8)* 40(PB4/JNTRST)* 41(PB5)* 42(PB6)* 43(PB7)* 45(PB8)* 46(PB9)*; U9 4(NC)*

### Layout directives
differential pair; net class DIFF90: USBSTLK_N, USBSTLK_P

### Notes on the sheet
- (near CN13) SWD STM32F103
- (near CN13) SWDIO
- (near CN13) NRST
- (near CN13) GND
- TX_STlink (VCP)
- RX_STlink (VCP)
- (near CN13) SWCLK
- (near CN13) SWO
- (near CN13) VREF
- SWO
- SWCLK
- SWDIO
- NRST
- Board Ident: PC13=0
- (near JMP11) JP5(3-4 to 15-16)
- (near CN14) RX
- TX
- (near CN14) USART2
- (near CN14) of STM32F103
- Title:
- Project:
- Size:
- Revision:
- Variant:
- A4
- -
- Date:
- Reference:
- Sheet:
- of
- (in symbol 1050170001) MicroB
- (in symbol LD_BICOLOR_CMS) Red; _Green

### Library data of the parts
C2 = MCD-00205: as C1 on sheet Extension_CN; Internal_Part_Number: MCD-00205; Status: Released; Part_Type: Capacitor; Package: C0402; ComponentLink1Description: Datasheet; ComponentLink1URL: http://tunmcdsvn.tun.st.com/Component_Datasheet_Library/Trunk/Capacitors/Yageo_Capacitor_NP0_16V-to-50V
C41-C50 = CAP_NPOL: Capacitor_not polarized
CN15 = 1050170001: as CN1 on sheet Extension_CN; ECCN_US/EU: n/a; Manuf_1: MOLEX; Manuf_Part_1: 1050170001; Distrib: DIGIKEY; Value: 1050170001; Order_Code: *
D2 = Diode: Default Diode; Code - JEDEC: DO-214-AB; Ordered by: STM; ECCN_US/EU: EAR99/NEC; Published: 8-Jun-2000; Revision: July-2002: Re-released for DXP Platform.; Publisher: Altium Limited
LED6 = LD_BICOLOR_CMS: Bicolor Led; Manuf_1: Avago Technologies; Manuf_2: kingbright; Manuf_Part_2: KAA-3528SURKCGKC; Manuf_Part_1: HSMF-A201-A00J1
Q1 = 2N2222: 2N2222_SOT23
R14-R32 = RES: Resistor
SB36-SB40 = Strap2: Solder Jumper; Solder: YES; Published: 24-Mar-1999; Revision: July-2002: Re-released for DXP Platform.; Publisher: Altium Limited
U7 = TXS0108EPW: TXS0108E Bi-directional Level Shifter TSSOP20
U8 = STM32F103CBT6: Medium-density performance line ARM-based 32-bit MCU with 128KB Flash; Manuf_1: STM; ECCN_US/EU: 3A991A2/NEC; Fitted: YES; Manuf_Part_1: STM32F103CBT6; Distrib: STM; Order_Code: STM32F103CBT6; Ordered_By: STM; Value: STM32F103CBT6
U9 = MCD-00649: as U6 on sheet Extension_CN; Internal_Part_Number: MCD-00649; Value: ECMF02-2AMX6; Status: Released; Manufacturer_Part_Number: ECMF02-2AMX6; ComponentLink1Description: Datasheet; ComponentLink1URL: http://tunmcdsvn.tun.st.com/Component_Datasheet_Library/Trunk/Diodes/STM_ESD_ECMF02-2AMX6
U13 = MCD-00251: as U11 on sheet Extension_CN; Internal_Part_Number: MCD-00251; Status: Released; Manufacturer_Part_Number: ESDA7P60-1U1M; ComponentLink1Description: Datasheet; ComponentLink1URL: http://tunmcdsvn.tun.st.com/Component_Datasheet_Library/Trunk/Diodes/STM_ESD_ESDA7P60-1U1M
X3 = MCD-00092: Crystal 8MHz, 8pF, +-20ppm, 500ohms max,  SMD; Part_Type: Crystal_Osc; Manufacturer_Part_Number: NX3225GD 8MHz EXS00A-CG04874; Manufacturer: NDK; BMS_Part_Number: 9157029; ECCN_US: EAR99; ECCN_EU: NEC; Provided_By: SUBCO; Internal_Part_Number: MCD-00092; Status: Released; ComponentLink1Description: Datasheet; ComponentLink1URL: http://tunmcdsvn.tun.st.com/Component_Datasheet_Library/Trunk/Crystal_Osc/NDK_Crystal-For-ST_NX3225GD 8MHz EXS00A-CG04874 (EXS10B-20725); Order_Code_Digikey: 644-1391

## Nets that join several sheets
3V3: Extension_CN (CN6.2 CN6.4 CN7.12 CN7.16), Power_Management (5 pins)
3V3_STLINK: Power_Management (C22.1 C27.1 U5.5), ST_LINK_V2-1 (20 pins)
5V: Extension_CN (CN6.5 CN7.18), Power_Management (10 pins), ST_LINK_V2-1 (D2.1)
5V_EXT: Extension_CN (CN7.6), Power_Management (JP1.1)
5V_INT: Extension_CN (R33.2), Power_Management (C9.1 JP1.3 U2.2)
5V_USB_MCU: Extension_CN (C1.2 CN1.1 CN10.8 U11.1), Power_Management (JP1.5)
5V_USB_STLINK: Power_Management (9 pins), ST_LINK_V2-1 (C2.1 CN15.1 R16.2 U13.1)
AVDD: Extension_CN (CN5.8 CN10.7), Power_Management (SB49.2 SB50.2 SB51.2)
GND: MCU (14 pins), RF (16 pins), Extension_CN (15 pins), Power_Management (39 pins), ST_LINK_V2-1 (37 pins)
VBAT: Extension_CN (CN7.33), Power_Management (C28.1 SB30.2 SB32.1 U1.1)
VDD: RF (JP4.1), Extension_CN (CN7.5), Power_Management (JP2.2 JP3.1 JP6.1 SB50.1), ST_LINK_V2-1 (JP5.11)
VIN: Extension_CN (CN6.8 CN7.24), Power_Management (C8.1 C10.1 SB24.2 U2.3)
BOOT0: MCU (R6.1 U1.5), Extension_CN (CN7.7)
NRST: MCU (D1.K SW4.1), Extension_CN (CN6.3 CN7.14), ST_LINK_V2-1 (JP5.3)
PA0: MCU (U1.15), Extension_CN (CN7.34 CN8.4)
PA1: MCU (U1.16), Extension_CN (CN8.3 SB14.2)
PA2: MCU (U1.17), Extension_CN (CN9.2 SB15.2)
PA3: MCU (U1.18), Extension_CN (CN9.1 CN10.37)
PA4: MCU (U1.19), Extension_CN (SB5.2 SB41.1)
PA5: MCU (U1.20), Extension_CN (CN5.6 CN10.11)
PA6: MCU (U1.21), Extension_CN (CN5.5 CN10.13)
PA7: MCU (U1.22), Extension_CN (CN5.4 SB1.2)
PA8: MCU (U1.23), Extension_CN (CN9.7 CN10.25)
PA9: MCU (U1.24), Extension_CN (CN5.2 SB8.2 SB10.1)
PA10: MCU (U1.51), Extension_CN (CN9.4 SB3.2 SB11.2)
PA13: MCU (U1.54), Extension_CN (CN7.13), ST_LINK_V2-1 (JP5.5)
PA14: MCU (U1.56), Extension_CN (CN7.15), ST_LINK_V2-1 (JP5.7)
PA15: MCU (U1.57), Extension_CN (CN9.6 CN10.27)
PB0: MCU (R3.1 SB22.1 U1.38), Extension_CN (CN10.22)
PB1: MCU (R4.1 SB23.1 U1.39), Extension_CN (CN10.24)
PB2: MCU (U1.27), Extension_CN (CN7.2)
PB3: MCU (U1.63), Extension_CN (SB13.1), ST_LINK_V2-1 (JP5.9)
PB4: MCU (U1.64), Extension_CN (CN10.4)
PB5: MCU (R2.1 U1.65), Extension_CN (SB7.1)
PB6: MCU (U1.66), Extension_CN (SB16.2 SB17.1), ST_LINK_V2-1 (JP5.13)
PB7: MCU (U1.67), Extension_CN (CN10.6), ST_LINK_V2-1 (JP5.15)
PB8: MCU (U1.6), Extension_CN (CN5.10 CN10.3)
PB9: MCU (U1.7), Extension_CN (CN5.9 CN10.5)
PB10: MCU (U1.28), Extension_CN (SB6.2 SB42.1)
PB11: MCU (U1.29), Extension_CN (CN7.1)
PB12: MCU (U1.46), Extension_CN (CN10.16)
PB13: MCU (U1.47), Extension_CN (SB12.1)
PB14: MCU (U1.48), Extension_CN (CN10.28)
PB15: MCU (U1.49), Extension_CN (SB9.1)
PC0: MCU (U1.9), Extension_CN (CN7.28 CN8.1)
PC1: MCU (U1.10), Extension_CN (CN7.30 CN8.2)
PC2: MCU (U1.11), Extension_CN (CN7.38 CN8.6)
PC3: MCU (U1.12), Extension_CN (CN7.36 CN8.5)
PC4: MCU (SB47.2 U1.25), Extension_CN (CN10.1)
PC5: MCU (U1.26), Extension_CN (CN7.3)
PC6: MCU (U1.50), Extension_CN (CN9.3 CN10.33)
PC10: MCU (U1.58), Extension_CN (CN9.5 CN10.29)
PC11: MCU (U1.59), Extension_CN (SB18.2)
PC12: MCU (U1.60), Extension_CN (CN5.1 CN10.21)
PC13: MCU (SB48.2 U1.2), Extension_CN (CN9.8 CN10.23)
PC14: MCU (SB45.2), Extension_CN (CN7.25)
PC15: MCU (SB46.2), Extension_CN (CN7.27)
PD0: MCU (R8.2 U1.61), Extension_CN (CN10.36)
PD1: MCU (R9.2 U1.62), Extension_CN (CN10.38)
PE4: MCU (U1.40), Extension_CN (CN7.4)
PWR_ENn: Power_Management (R11.2 U4.4), ST_LINK_V2-1 (U8.28)
USB_N: MCU (U1.52), Extension_CN (SB4.1 U6.2)
USB_P: MCU (U1.53), Extension_CN (SB2.1 U6.1)

## Assembly variants
WB55RG: not fitted C36 C39 C40 CN3 CN4 CN13 CN14 J2 R13 R30 SK_BT1